# EAGLE schematic wb_imx233_core_rev_c3 (EAGLE 6.4)
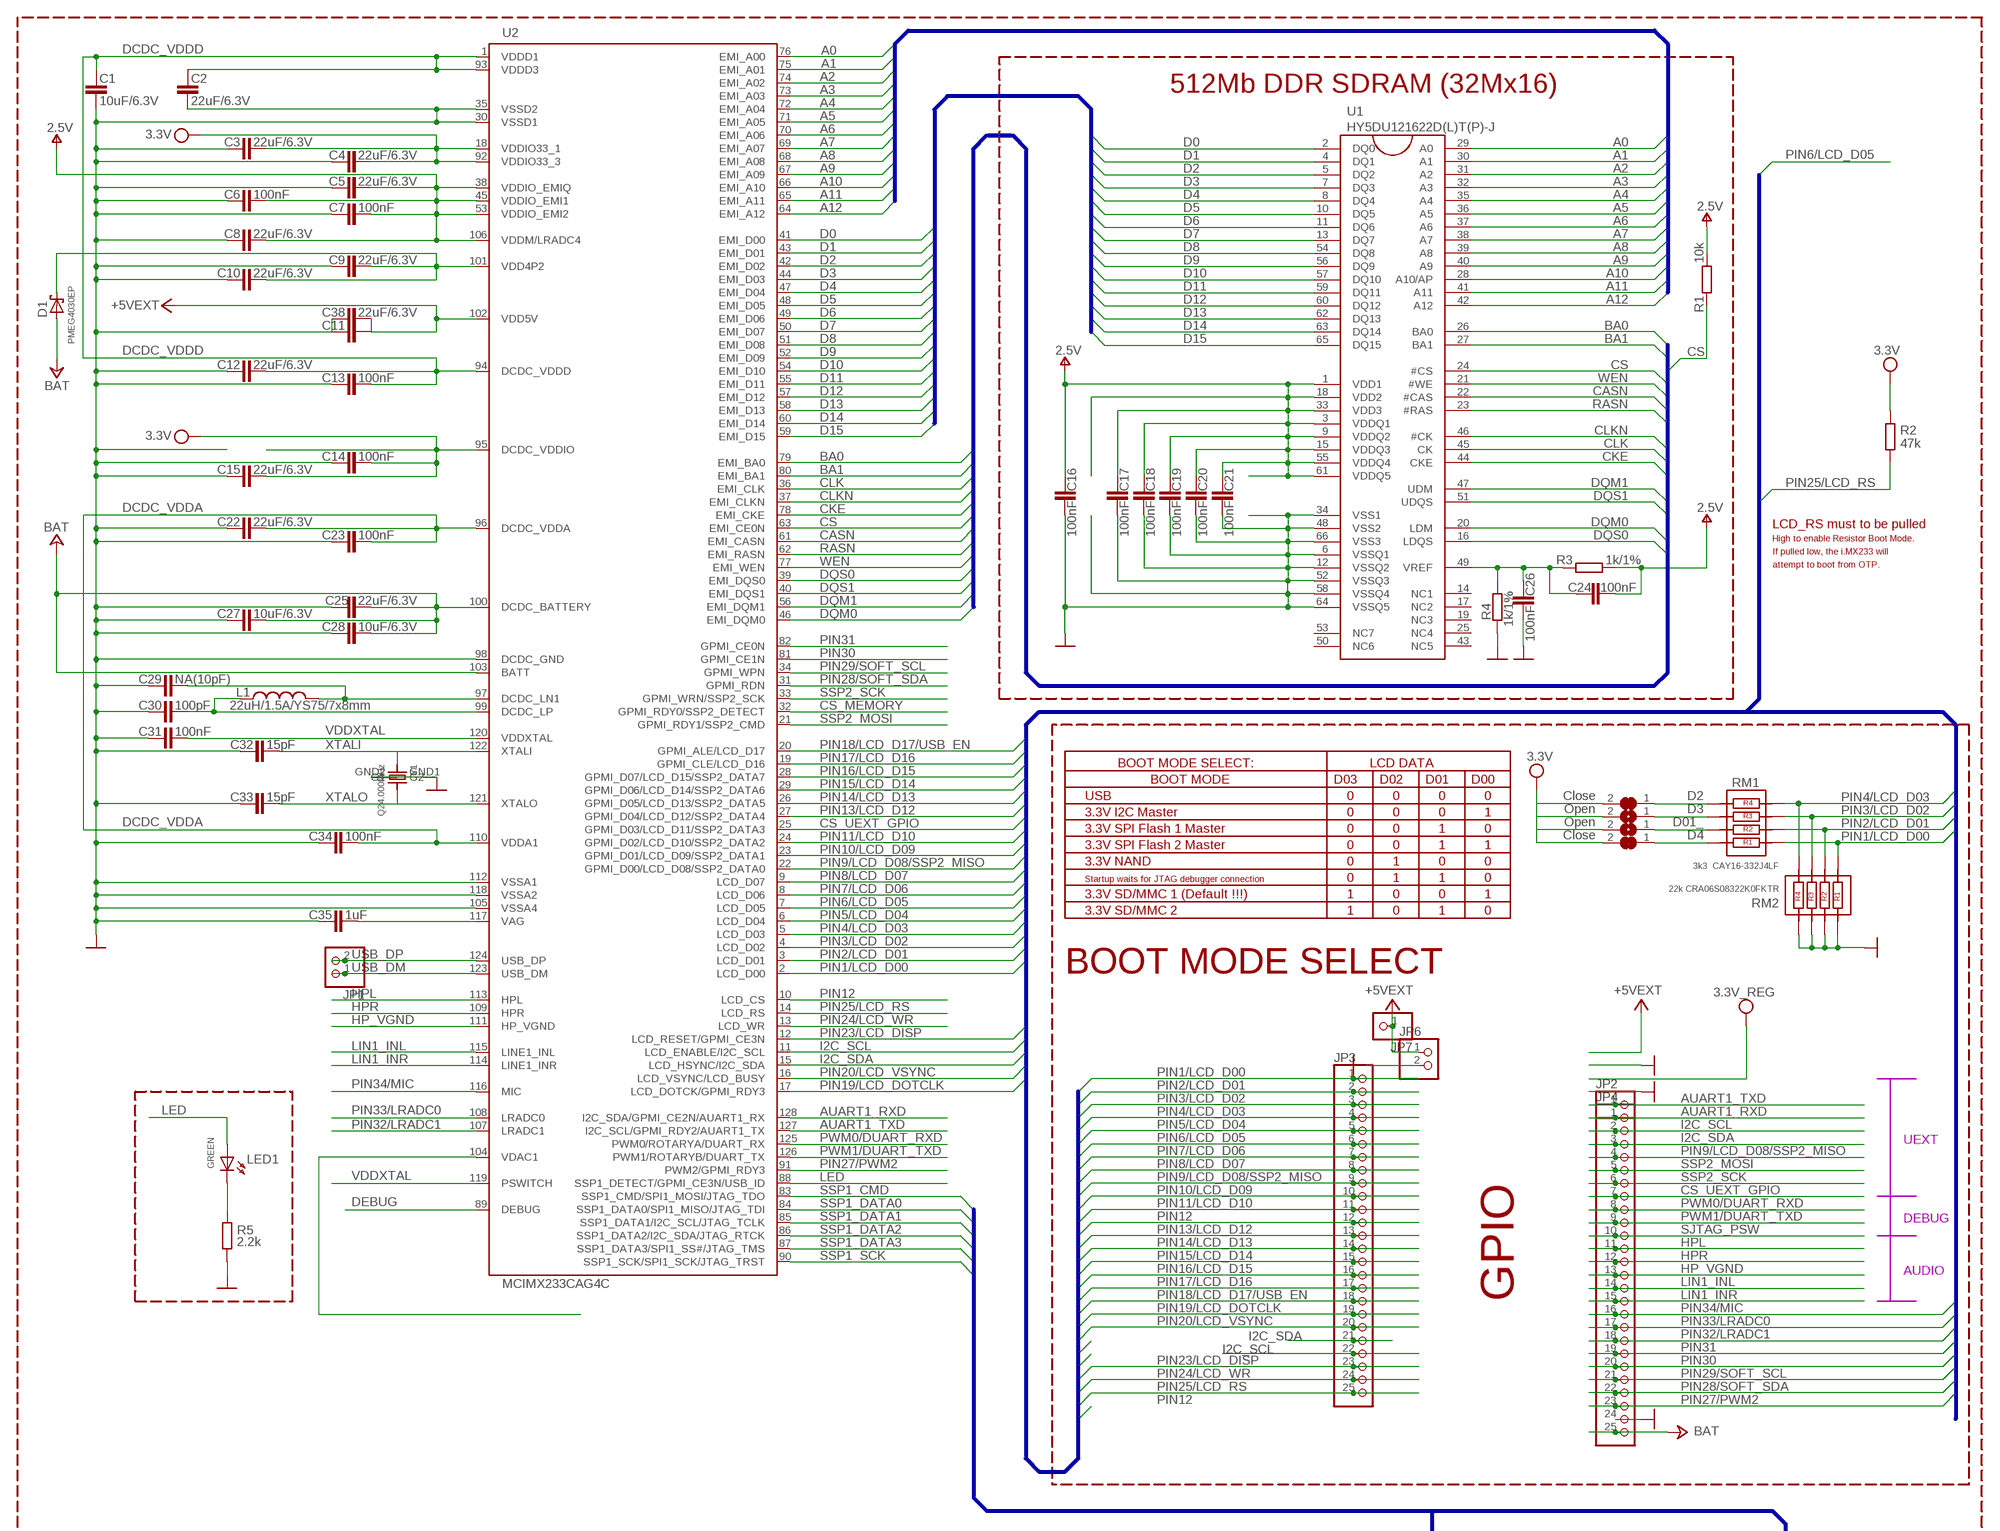
[diagram p0: schematic, sheet 1, part 1 of 2]
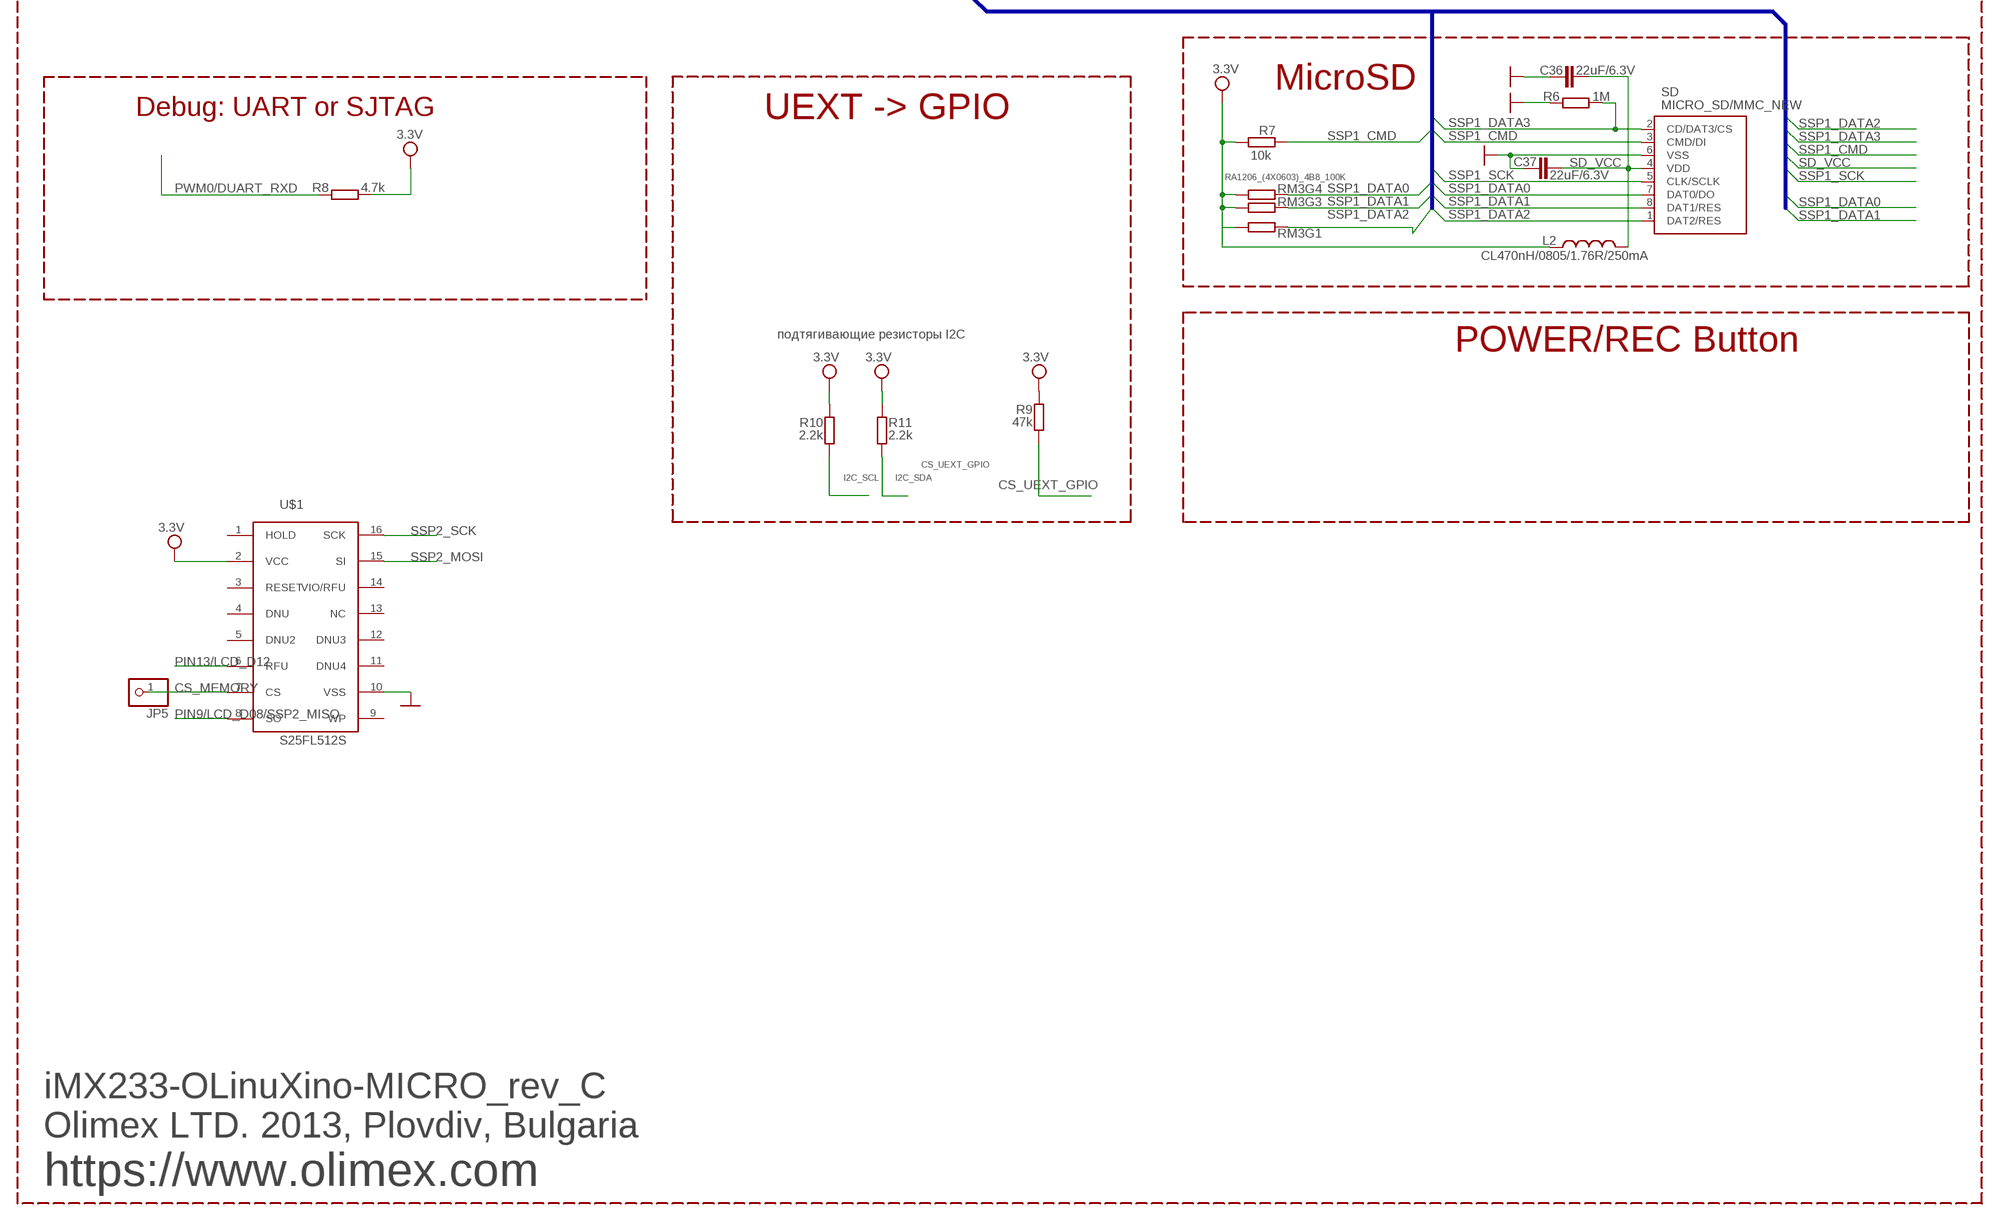
[diagram p1: schematic, sheet 1, part 2 of 2]

## Parts
C1  10uF/6.3V  C-EUC0603_DWS  [C0603_DWS]
C2  22uF/6.3V  C-EUC0603_DWS  [C0603_DWS]
C3  22uF/6.3V  C-EUC0603_DWS  [C0603_DWS]
C4  22uF/6.3V  C-EUC0603_DWS  [C0603_DWS]
C5  22uF/6.3V  C-EUC0603_DWS  [C0603_DWS]
C6  100nF  C-EUC0603_DWS  [C0603_DWS]
C7  100nF  C-EUC0603_DWS  [C0603_DWS]
C8  22uF/6.3V  C-EUC0603_DWS  [C0603_DWS]
C9  22uF/6.3V  C-EUC0603_DWS  [C0603_DWS]
C10  22uF/6.3V  C-EUC0603_DWS  [C0603_DWS]
C11  100nF  C-EUC0603_DWS  [C0603_DWS]
C12  22uF/6.3V  C-EUC0603_DWS  [C0603_DWS]
C13  100nF  C-EUC0603_DWS  [C0603_DWS]
C14  100nF  C-EUC0603_DWS  [C0603_DWS]
C15  22uF/6.3V  C-EUC0603_DWS  [C0603_DWS]
C16  100nF  C-EUC0603_DWS  [C0603_DWS]
C17  100nF  C-EUC0603_DWS  [C0603_DWS]
C18  100nF  C-EUC0603_DWS  [C0603_DWS]
C19  100nF  C-EUC0603_DWS  [C0603_DWS]
C20  100nF  C-EUC0603_DWS  [C0603_DWS]
C21  100nF  C-EUC0603_DWS  [C0603_DWS]
C22  22uF/6.3V  C-EUC0603_DWS  [C0603_DWS]
C23  100nF  C-EUC0603_DWS  [C0603_DWS]
C24  100nF  C-EUC0603_DWS  [C0603_DWS]
C25  22uF/6.3V  C-EUC0603_DWS  [C0603_DWS]
C26  100nF  C-EUC0603_DWS  [C0603_DWS]
C27  10uF/6.3V  C-EUC0603_DWS  [C0603_DWS]
C28  10uF/6.3V  C-EUC0603_DWS  [C0603_DWS]
C29  NA(10pF)  C-EUC0603_DWS  [C0603_DWS]
C30  100pF  C-EUC0603_DWS  [C0603_DWS]
C31  100nF  C-EUC0603_DWS  [C0603_DWS]
C32  15pF  C-EUC0603_DWS  [C0603_DWS]
C33  15pF  C-EUC0603_DWS  [C0603_DWS]
C34  100nF  C-EUC0603_DWS  [C0603_DWS]
C35  1uF  C-EUC0603_DWS  [C0603_DWS]
C36  22uF/6.3V  C-EUC0603_DWS  [C0603_DWS]
C37  22uF/6.3V  C-EUC0603_DWS  [C0603_DWS]
C38  22uF/6.3V  C-EUC0603_DWS  [C0603_DWS]
D1  PMEG4030EP  SCHOTKKY7.62SS2  [MLL-41]
D01_  Open  SJSJ_SMALLER  [SJ_1_SMALLER]
D2  Close  SJSJ_SMALLER  [SJ_1_SMALLER]
D3  Open  SJSJ_SMALLER  [SJ_1_SMALLER]
D4  Close  SJSJ_SMALLER  [SJ_1_SMALLER]
JP1  PINHD-1X2  [1X02-R]
JP2  PINHD-1X1  [1X01]
JP3  PINHD-1X25  [1X25]
JP4  PINHD-1X25  [1X25]
JP5  PINHD-1X1  [1X01]
JP6  PINHD-1X2  [1X02-R]
JP7  PINHD-1X1  [1X01]
L1  22uH/1.5A/YS75/7x8mm  L-USL7078  [L7078]
L2  CL470nH/0805/1.76R/250mA  L-USL0805_5MIL_DWS  [L0805_5MIL_DWS]
LED1  GREEN  LED0805DWS  [LED-0805]
R1  10k  R-EU_R0603_5MIL_DWS  [R0603_5MIL_DWS]
R2  47k  R-EU_R0603_5MIL_DWS  [R0603_5MIL_DWS]
R3  1k/1%  R-EU_R0603_5MIL_DWS  [R0603_5MIL_DWS]
R4  1k/1%  R-EU_R0603_5MIL_DWS  [R0603_5MIL_DWS]
R5  2.2k  R-EU_R0603_5MIL_DWS  [R0603_5MIL_DWS]
R6  1M  R-EU_R0603_5MIL_DWS  [R0603_5MIL_DWS]
R7  10k  R-EU_R0603_5MIL_DWS  [R0603_5MIL_DWS]
R8  4.7k  R-EU_R0603_5MIL_DWS  [R0603_5MIL_DWS]
R9  47k  R-EU_R0603_5MIL_DWS  [R0603_5MIL_DWS]
R10  2.2k  R-EU_R0603_5MIL_DWS  [R0603_5MIL_DWS]
R11  2.2k  R-EU_R0603_5MIL_DWS  [R0603_5MIL_DWS]
RM1  3k3 CAY16-332J4LF  R_MATRIX_4  [R_MATRIX_4]
RM2  22k CRA06S08322K0FKTR  R_MATRIX_4  [R_MATRIX_4]
RM3  RA1206_(4X0603)_4B8_100K  R_MATRIX_4E  [R_MATRIX_4]
SD  MICRO_SD/MMC_NEW  [TFR/C-MEM-CON]
U1  HY5DU121622D(L)T(P)-J  [66TSOP-II]
U2  MCIMX233CAG4C  MCIMX233DAG4B_LD  [TQFP128LD]
U$1  S25FL512S  [1]
Y1  Q24.000MHz  CRYSTALTHIN  [CRYSTAL_3.2X2.5]

## Nets
+5V: C11.2 C38.2 JP6.1 JP7.1 U2.102(VDD5V) ; supply symbol labelled +5VEXT
+24V: C25.2 C27.2 C28.2 D1.A JP4.25 U2.100(DCDC_BATTERY) U2.103(BATT) ; supply symbol labelled BAT
A0: U1.29(A0) U2.76(EMI_A00)
A1: U1.30(A1) U2.75(EMI_A01)
A2: U1.31(A2) U2.74(EMI_A02)
A3: U1.32(A3) U2.73(EMI_A03)
A4: U1.35(A4) U2.72(EMI_A04)
A5: U1.36(A5) U2.71(EMI_A05)
A6: U1.37(A6) U2.70(EMI_A06)
A7: U1.38(A7) U2.69(EMI_A07)
A8: U1.39(A8) U2.68(EMI_A08)
A9: U1.40(A9) U2.67(EMI_A09)
A10: U1.28(A10/AP) U2.66(EMI_A10)
A11: U1.41(A11) U2.65(EMI_A11)
A12: U1.42(A12) U2.64(EMI_A12)
AUART1_RXD: JP4.1 U2.128(I2C_SDA/GPMI_CE2N/AUART1_RX)
AUART1_TXD: JP2.1 U2.127(I2C_SCL/GPMI_RDY2/AUART1_TX)
BA0: U1.26(BA0) U2.79(EMI_BA0)
BA1: U1.27(BA1) U2.80(EMI_BA1)
CASN: U1.22(#CAS) U2.61(EMI_CASN)
CKE: U1.44(CKE) U2.78(EMI_CKE)
CLK: U1.45(CK) U2.36(EMI_CLK)
CLKN: U1.46(#CK) U2.37(EMI_CLKN)
CS: R1.1 U1.24(#CS) U2.63(EMI_CE0N)
CS_MEMORY: JP5.1 U2.32(GPMI_RDY0/SSP2_DETECT) U$1.7(CS)
CS_UEXT_GPIO: JP4.7 R9.1 U2.25(GPMI_D03/LCD_D11/SSP2_DATA3)
D0: U1.2(DQ0) U2.41(EMI_D00)
D1: U1.4(DQ1) U2.43(EMI_D01)
D2: U1.5(DQ2) U2.42(EMI_D02)
D3: U1.7(DQ3) U2.44(EMI_D03)
D4: U1.8(DQ4) U2.47(EMI_D04)
D5: U1.10(DQ5) U2.48(EMI_D05)
D6: U1.11(DQ6) U2.49(EMI_D06)
D7: U1.13(DQ7) U2.50(EMI_D07)
D8: U1.54(DQ8) U2.51(EMI_D08)
D9: U1.56(DQ9) U2.52(EMI_D09)
D10: U1.57(DQ10) U2.54(EMI_D10)
D11: U1.59(DQ11) U2.55(EMI_D11)
D12: U1.60(DQ12) U2.57(EMI_D12)
D13: U1.62(DQ13) U2.58(EMI_D13)
D14: U1.63(DQ14) U2.60(EMI_D14)
D15: U1.65(DQ15) U2.59(EMI_D15)
DCDC_VDDA: C22.2 C23.2 C34.2 U2.96(DCDC_VDDA) U2.110(VDDA1)
DCDC_VDDD: C1.2 C2.2 C12.2 C13.2 U2.1(VDDD1) U2.93(VDDD3) U2.94(DCDC_VDDD)
DEBUG: U2.89(DEBUG)
DQM0: U1.20(LDM) U2.46(EMI_DQM0)
DQM1: U1.47(UDM) U2.56(EMI_DQM1)
DQS0: U1.16(LDQS) U2.39(EMI_DQS0)
DQS1: U1.51(UDQS) U2.40(EMI_DQS1)
GND [PWR]: C1.1 C2.1 C3.1 C4.1 C5.1 C6.1 C7.1 C8.1 C9.1 C10.1 C11.1 C12.1 C13.1 C14.1 C15.1 C16.1 C17.1 C18.1 C19.1 C20.1 C21.1 C22.1 C23.1 C25.1 C26.1 C27.1 C28.1 C29.1 C30.1 C31.1 C32.1 C33.1 C34.1 C35.1 C36.1 C37.1 C38.1 JP4.24 JP6.2 R4.1 R5.1 R6.2 RM2.1.2 RM2.2.2 RM2.3.2 RM2.4.2 SD.6(VSS) U1.6(VSSQ1) U1.12(VSSQ2) U1.34(VSS1) U1.48(VSS2) U1.52(VSSQ3) U1.58(VSSQ4) U1.64(VSSQ5) U1.66(VSS3) U2.30(VSSD1) U2.35(VSSD2) U2.98(DCDC_GND) U2.105(VSSA4) U2.112(VSSA1) U2.118(VSSA2) U$1.10(VSS) Y1.GND1(G1) Y1.GND2(G2)
HP_VGND: JP4.13 U2.111(HP_VGND)
HPL: JP4.11 U2.113(HPL)
HPR: JP4.12 U2.109(HPR)
I2C_SCL: JP3.22 JP4.2 R10.1 U2.11(LCD_ENABLE/I2C_SCL)
I2C_SDA: JP3.21 JP4.3 R11.1 U2.15(LCD_HSYNC/I2C_SDA)
LED: LED1.A U2.88(SSP1_DETECT/GPMI_CE3N/USB_ID)
LIN1_INL: JP4.14 U2.115(LINE1_INL)
LIN1_INR: JP4.15 U2.114(LINE1_INR)
N$1: D2.1 RM1.4.1
N$3: D3.1 RM1.3.1
N$4: D01_.1 RM1.2.1
N$5: D4.1 RM1.1.1
N$7: C24.2 C26.2 R3.1 R4.2 U1.49(VREF)
N$18: C29.2 L1.2 U2.97(DCDC_LN1)
N$19: C30.2 L1.1 U2.99(DCDC_LP)
N$25: C35.2 U2.117(VAG)
N$42: LED1.C R5.2
PIN1/LCD_D00: JP3.1 RM1.1.2 RM2.1.1 U2.2(LCD_D00)
PIN2/LCD_D01: JP3.2 RM1.2.2 RM2.2.1 U2.3(LCD_D01)
PIN3/LCD_D02: JP3.3 RM1.3.2 RM2.3.1 U2.4(LCD_D02)
PIN4/LCD_D03: JP3.4 RM1.4.2 RM2.4.1 U2.5(LCD_D03)
PIN5/LCD_D04: JP3.5 U2.6(LCD_D04)
PIN6/LCD_D05: JP3.6 U2.7(LCD_D05)
PIN7/LCD_D06: JP3.7 U2.8(LCD_D06)
PIN8/LCD_D07: JP3.8 U2.9(LCD_D07)
PIN9/LCD_D08/SSP2_MISO: JP3.9 JP4.4 U2.22(GPMI_D00/LCD_D08/SSP2_DATA0) U$1.8(SO)
PIN10/LCD_D09: JP3.10 U2.23(GPMI_D01/LCD_D09/SSP2_DATA1)
PIN11/LCD_D10: JP3.11 U2.24(GPMI_D02/LCD_D10/SSP2_DATA2)
PIN12: JP3.12 U2.10(LCD_CS)
PIN13/LCD_D12: JP3.13 U2.27(GPMI_D04/LCD_D12/SSP2_DATA4) U$1.6(RFU)
PIN14/LCD_D13: JP3.14 U2.26(GPMI_D05/LCD_D13/SSP2_DATA5)
PIN15/LCD_D14: JP3.15 U2.29(GPMI_D06/LCD_D14/SSP2_DATA6)
PIN16/LCD_D15: JP3.16 U2.28(GPMI_D07/LCD_D15/SSP2_DATA7)
PIN17/LCD_D16: JP3.17 U2.19(GPMI_CLE/LCD_D16)
PIN18/LCD_D17/USB_EN: JP3.18 U2.20(GPMI_ALE/LCD_D17)
PIN19/LCD_DOTCLK: JP3.19 U2.17(LCD_DOTCK/GPMI_RDY3)
PIN20/LCD_VSYNC: JP3.20 U2.16(LCD_VSYNC/LCD_BUSY)
PIN23/LCD_DISP: JP3.23 U2.12(LCD_RESET/GPMI_CE3N)
PIN24/LCD_WR: JP3.24 U2.13(LCD_WR)
PIN25/LCD_RS: JP3.25 R2.2 U2.14(LCD_RS)
PIN27/PWM2: JP4.23 U2.91(PWM2/GPMI_RDY3)
PIN28/SOFT_SDA: JP4.22 U2.31(GPMI_RDN)
PIN29/SOFT_SCL: JP4.21 U2.34(GPMI_WPN)
PIN30: JP4.20 U2.81(GPMI_CE1N)
PIN31: JP4.19 U2.82(GPMI_CE0N)
PIN32/LRADC1: JP4.18 U2.107(LRADC1)
PIN33/LRADC0: JP4.17 U2.108(LRADC0)
PIN34/MIC: JP4.16 U2.116(MIC)
PWM0/DUART_RXD: JP4.8 R8.2 U2.125(PWM0/ROTARYA/DUART_RX)
PWM1/DUART_TXD: JP4.9 U2.126(PWM1/ROTARYB/DUART_TX)
RASN: U1.23(#RAS) U2.62(EMI_RASN)
SD_VCC: C36.2 C37.2 L2.2 SD.4(VDD)
SJTAG_PSW: JP4.10
SSP1_CMD: R7.1 SD.3(CMD/DI) U2.83(SSP1_CMD/SPI1_MOSI/JTAG_TDO)
SSP1_DATA0: RM3.4.1 SD.7(DAT0/DO) U2.84(SSP1_DATA0/SPI1_MISO/JTAG_TDI)
SSP1_DATA1: RM3.3.1 SD.8(DAT1/RES) U2.85(SSP1_DATA1/I2C_SCL/JTAG_TCLK)
SSP1_DATA2: RM3.1.1 SD.1(DAT2/RES) U2.86(SSP1_DATA2/I2C_SDA/JTAG_RTCK)
SSP1_DATA3: R6.1 SD.2(CD/DAT3/CS) U2.87(SSP1_DATA3/SPI1_SS#/JTAG_TMS)
SSP1_SCK: SD.5(CLK/SCLK) U2.90(SSP1_SCK/SPI1_SCK/JTAG_TRST)
SSP2_MOSI: JP4.5 U2.21(GPMI_RDY1/SSP2_CMD) U$1.15(SI)
SSP2_SCK: JP4.6 U2.33(GPMI_WRN/SSP2_SCK) U$1.16(SCK)
USB_DM: JP1.1 U2.123(USB_DM)
USB_DP: JP1.2 U2.124(USB_DP)
V+: C5.2 C6.2 C7.2 C8.2 C16.2 C17.2 C18.2 C19.2 C20.2 C21.2 C24.1 R1.2 R3.2 U1.1(VDD1) U1.3(VDDQ1) U1.9(VDDQ2) U1.15(VDDQ3) U1.18(VDD2) U1.33(VDD3) U1.55(VDDQ4) U1.61(VDDQ5) U2.38(VDDIO_EMIQ) U2.45(VDDIO_EMI1) U2.53(VDDIO_EMI2) U2.106(VDDM/LRADC4) ; supply symbol labelled 2.5V
VCC [PWR]: C3.2 C4.2 C14.2 C15.2 D01_.2 D2.2 D3.2 D4.2 L2.1 R2.1 R7.2 R8.1 R9.2 R10.2 R11.2 RM3.1.2 RM3.3.2 RM3.4.2 U2.18(VDDIO33_1) U2.92(VDDIO33_3) U2.95(DCDC_VDDIO) U$1.2(VCC) ; supply symbol labelled 3.3V
VDAC1: U2.104(VDAC1)
VDD4P2: C9.2 C10.2 D1.K(C) U2.101(VDD4P2)
VDDXTAL: C31.2 U2.119(PSWITCH) U2.120(VDDXTAL)
WEN: U1.21(#WE) U2.77(EMI_WEN)
XTALI: C32.2 U2.122(XTALI) Y1.1
XTALO: C33.2 U2.121(XTALO) Y1.2
Unconnected: RM3.2.1 RM3.2.2 U1.14(NC1) U1.17(NC2) U1.19(NC3) U1.25(NC4) U1.43(NC5) U1.50(NC6) U1.53(NC7) U$1.1(HOLD) U$1.3(RESET) U$1.4(DNU) U$1.5(DNU2) U$1.9(WP) U$1.11(DNU4) U$1.12(DNU3) U$1.13(NC) U$1.14(VIO/RFU)

## Buses
A[0..12]
D[0..15]
SSP1_CMD/SPI1_MOSI,SSP1_DATA0/SPI1_MISO,SSP1_SCK/SPI1_SCK,SSP1_DATA3/SPI1_SS#,SSP1_DATA1/I2C_SCL,SSP1_DATA2/I2C_SDA
LCD_D17,LCD_D16,LCD_D15,LCD_D14,LCD_D13,LCD_D12,LCD_D11,LCD_D10,LCD_D09,LCD_D08/SSP2_MISO,LCD_D07,LCD_D06,LCD_D05,LCD_D04,LCD_D03,LCD_D02,LCD_D01,LCD_D00,LCD_DOTCLK,LCD_VSYNC,LCD_HSYNC/I2C_SDA,LCD_EN/I2C_SCL,LCD_DISP
BA[0..1],CLK,CLKN,CKE,CS,CASN,RASN,WEN,DQM[0..1],DQS[0..1]

## Notes on the sheet
- 512Mb DDR SDRAM (32Mx16)
- LCD_RS must to be pulled
- High to enable Resistor Boot Mode.
- If pulled low, the i.MX233 will
- attempt to boot from OTP.
- BOOT MODE SELECT: | LCD DATA
- BOOT MODE | D03 | D02 | D01 | D00
- USB | 0 | 0 | 0 | 0
- 3.3V I2C Master | 0 | 0 | 0 | 1
- 3.3V SPI Flash 1 Master | 0 | 0 | 1 | 0
- 3.3V SPI Flash 2 Master | 0 | 0 | 1 | 1
- 3.3V NAND | 0 | 1 | 0 | 0
- Startup waits for JTAG debugger connection | 0 | 1 | 1 | 0
- 3.3V SD/MMC 1 (Default !!!) | 1 | 0 | 0 | 1
- 3.3V SD/MMC 2 | 1 | 0 | 1 | 0
- BOOT MODE SELECT
- UEXT
- DEBUG
- AUDIO
- GPIO
- MicroSD
- Debug: UART or SJTAG | UEXT -> GPIO
- подтягивающие резисторы I2C
- POWER/REC Button
- iMX233-OLinuXino-MICRO_rev_C
- Olimex LTD. 2013, Plovdiv, Bulgaria
- https://www.olimex.com

## Library data of the parts
C1-C38 = rcl:C-EU: CAPACITOR, European symbol
D1 = gogo:SCHOTKKY7.62SS
D01_ D2-D4 = jumper:SJ: SMD solder JUMPER
JP1 JP6 = pinhead:PINHD-1X2: PIN HEADER
JP2 JP5 JP7 = pinhead:PINHD-1X1: PIN HEADER
JP3 JP4 = pinhead:PINHD-1X25: PIN HEADER
L1 L2 = rcl:L-US: INDUCTOR, American symbol
LED1 = DOUBLE-SIDE:LED
R1-R11 = rcl:R-EU_: RESISTOR, European symbol
RM1 RM2 = OLIMEX_DISCRET:R_MATRIX_4
RM3 = OLIMEX_DISCRET:R_MATRIX_4E
SD = OLIMEX_CONNECTORS:MICRO_SD/MMC
U1 = OLIMEX_IC:HY5DU121622D(L)T(P)
U2 = OLIMEX_IC:MCIMX233DAG4B: i.MX23
U$1 = !память:S25FL512S
Y1 = microbuilder:CRYSTAL: Crystals HC49UP - Surface Mount Crystal 4.0MHz 18pF +/-30ppm Surface Mount Crystal [Digikey: 535-9857-1-ND] 12.0 MHz Surface Mount Crystal [Digikey: 535-9869-6-ND] 25.0 MHz Surface Mount Crystal [Digikey: 535-9078-1-ND] 2.5 x 2.0mm - MEMs SMT Crystal 16.0 MHz 10pF 20ppm 2.5 x 2.0mm Crystal [Digikey -40-85°C: 535-10923-1-ND] 3.2 x 2.5mm - MEMs SMT Crystal 12.0 MHz 8pF 15ppm 3.2 x 2.5mm Crystal [Digikey: -10-70°C: 644-1047-1-ND -40-125°C: 644-1128-1-ND] 16.0 MHz 8pF 15ppm 3.2 x 2.5mm Crystal [Digikey: -10-70°C: 644-1049-1-ND -40-125°C: 644-1129-2-ND] 16.0 MHz 10pF 10ppm 3.2 x 2.5mm Crystal [Digikey: 644-1100-1-ND] 27.12 MHz 18pF 30ppm 3.2 x 2.5mm Crystal [Digikey: 887-1424-1-ND] 27.12MHz 10pF 10ppm 3.2 x 2.5mm Crystal [Digikey: 887-1329-1-ND] 4.9 x 1.8mm - MEMs SMT Crystal 32.768 KHz 12.5pF 20ppm 4.9 x 1.8mm Crystal [Digikey: SE2415CT-ND] 8.0 x 3.8mm - Surface Mount Crystal 32.768kHz 12.5pF 20ppm -40°C-85°C [Digikey: 535-9166-2-ND] Cylinder 32.768KHz Cylinder Crystal (2x6mm body) [Ex. Digikey: 300-8341-2-ND]

## Net classes
1 PWR: width 0.203 mm, drill 0.4 mm, clearance 0.076 mm